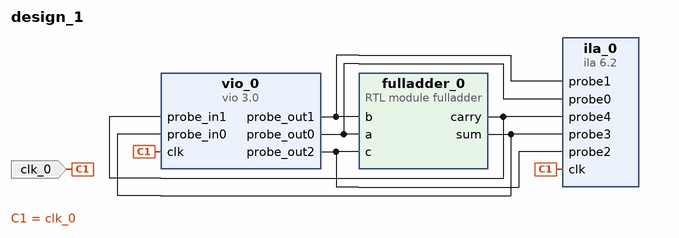
[diagram p0: block diagram of the top level]
# Vivado block design design_1, xc7a35tftg256-1, Vivado 2024.2
create_bd_design design_1

create_bd_port -dir I -type clk clk_0

create_bd_cell -type module -reference fulladder fulladder_0
create_bd_cell -type ip -vlnv xilinx.com:ip:vio:3.0 vio_0
set_property -dict {CONFIG.C_NUM_PROBE_IN 2 CONFIG.C_NUM_PROBE_OUT 3} [get_bd_cells vio_0]
create_bd_cell -type ip -vlnv xilinx.com:ip:ila:6.2 ila_0
set_property -dict {CONFIG.C_MONITOR_TYPE Native CONFIG.C_NUM_OF_PROBES 5} [get_bd_cells ila_0]

# ---- connections ----

connect_bd_net [get_bd_pins vio_0/probe_out1] [get_bd_pins ila_0/probe1] [get_bd_pins fulladder_0/b]
connect_bd_net [get_bd_pins vio_0/probe_out0] [get_bd_pins ila_0/probe0] [get_bd_pins fulladder_0/a]
connect_bd_net -net clk_0_1 [get_bd_ports clk_0] [get_bd_pins ila_0/clk] [get_bd_pins vio_0/clk]
connect_bd_net [get_bd_pins fulladder_0/carry] [get_bd_pins vio_0/probe_in1] [get_bd_pins ila_0/probe4]
connect_bd_net [get_bd_pins fulladder_0/sum] [get_bd_pins vio_0/probe_in0] [get_bd_pins ila_0/probe3]
connect_bd_net [get_bd_pins vio_0/probe_out2] [get_bd_pins fulladder_0/c] [get_bd_pins ila_0/probe2]

validate_bd_design
save_bd_design
